# Altium schematic sheet LPSP_VoltageInput.SchDoc
size A3; Organization: Canis Tech; Address1: -; Address2: -; Address3: -; Address4: Indaiatuba/SP; Address5: Brazil
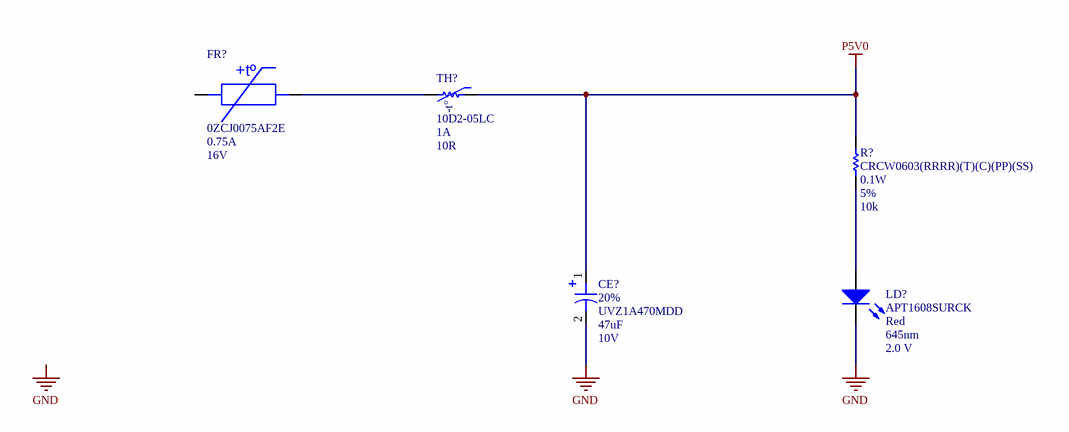
[diagram p0: LPSP_VoltageInput.SchDoc]

## Parts
CE?  value 47uF  Tolerance: 20%  PartNumber1: UVZ1A470MDD  Voltage: 10V  [2.0-5.0-11.0]  (hidden comment: 10V 47uF)
FR?  HoldCurrent: 0.75A  Voltage: 16V  [FUS1206]  (hidden comment: 0ZCJ0075AF2E)
LD?  Colour: Red  Wavelength: 645nm  Vled: 2.0 V  [LED0603]  (hidden comment: APT1608SURCK)
R?  value 10k  PartNumber1: CRCW0603(RRRR)(T)(C)(PP)(SS)  Power: 0.1W  Tolerance: 5%  [RES0603]  (hidden comment: Chip Resistor)
TH?  value 10R  Current: 1A  [NTC D2 DIA05mm]  (hidden comment: 10D2-05LC)

## Nets
GND: CE?.2 LD?.K
P5V0: CE?.1 R?.2 TH?.1
NetFR?_2: FR?.2 TH?.2
NetLD?_A: LD?.A R?.1

Not connected (* = marked no-connect by the designer): FR? 1

## Notes on the sheet
- Labels drawn without touching a wire or pin: GND
- Title
- Author
- Checked By
- Variant
- Size:
- Revision:
- A3
- Date:
- Project
- Time:
- Sheet
- of
- File:
- (in symbol 0ZCJ0075AF2E) +tº
- (in symbol 10D2-05LC) -t°

## Library data of the parts
CE? = 10V 47uF: Electrolytic Capacitor PTH; Manufacturer1: Nichicon; Code: 470; Published: 26-Dec-2016; LatestRevisionDate: 26-Dec-2016; PackageReference: 2-5; Publisher: Lucas Moraes; PackageDescription: 2-5;2 leads; LatestRevisionNote: Created
FR? = 0ZCJ0075AF2E: PPTC 0ZCJ Series 1206 - 0.75A 16V; Manufacturer1: Bel; Published: 19-Dec-2024; LatestRevisionDate: 19-Dec-2024; LatestRevisionNote: Created; PackageReference: FUS1206; Publisher: Lucas Moraes; PackageDescription: FUS1206; 2 Leads; PartNumber1: 0ZCJ0075AF2E
LD? = APT1608SURCK: Standard LEDs - SMD 0603 Red; Manufacturer1: Kingbright; LastRevisionNote: Created; Published: 28-Mar-2023; PackageReference: LED0603; Publisher: Lucas Moraes; PackageDescription: LED0603; 2 leads; LastRevision: 28-Mar-2023; Datasheet: https://www.mouser.com/datasheet/2/216/APT1608SURCK-41133.pdf; PartNumber1: APT1608SURCK
R? = CRCW0603: Thick Film Chip Resistors with CECC Approval,  available with Established Reliability; Manufacturer1: Vishay; LatestRevisionDate: 06-May-2016; PackageReference: 0603; Publisher: Lucas Moraes; PackageDescription: SMD 0603; 2 Leads; Published: 06-May-2016
TH? = 10D2-05LC: NTC Thermistors Semitec Clinch lead; LatestRevisionDate: 26-Nov-2022; PackageReference: NTC D2 DIA05mm; Publisher: Lucas Moraes; PackageDescription: NTC D2 DIA05mm; 2 Leads; Published: 26-Nov-2022; Manufacturer1: Semitec; PartNumber1: 10D2-05LC